# Altium schematic sheet stm32-motor-driver.SchDoc
size Letter
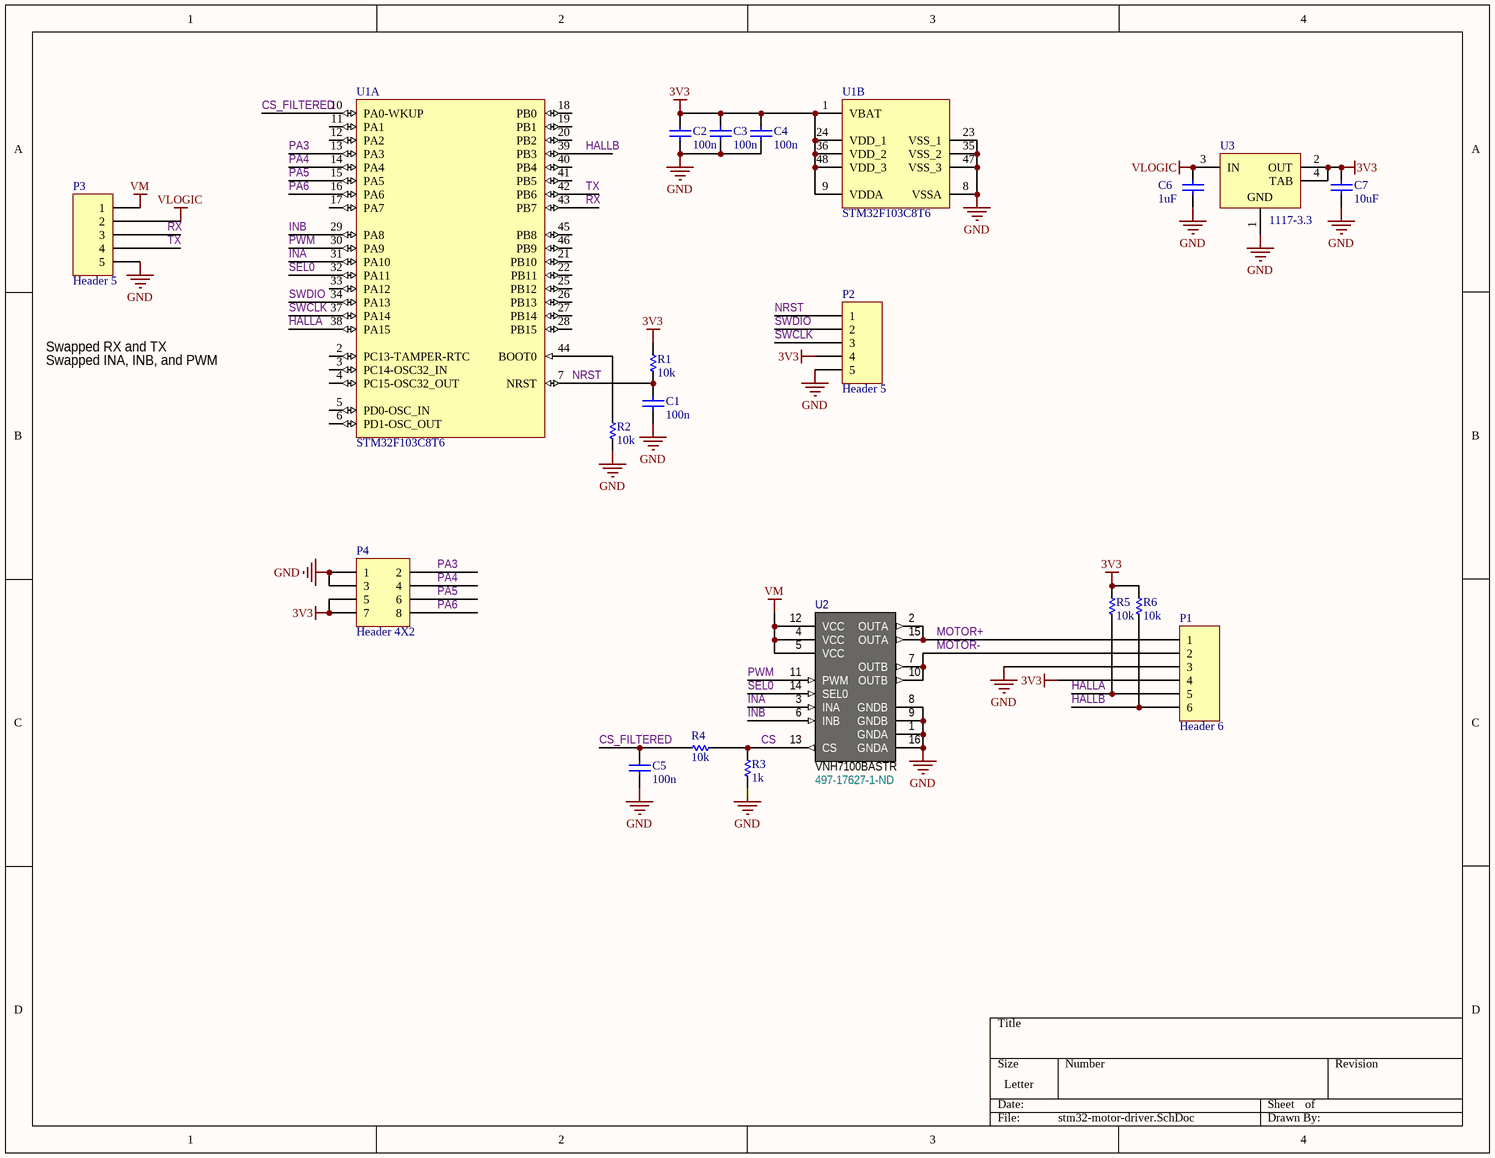
[diagram p0: stm32-motor-driver.SchDoc]

## Parts
C1  value 100n  [CAPC1608N]
C2  value 100n  [CAPC1608N]
C3  value 100n  [CAPC1608N]
C4  value 100n  [CAPC1608N]
C5  value 100n  [CAPC1608N]
C6  value 1uF  [CAPC1608N]
C7  value 10uF  [CAPC1608N]
P1  Header 6  [HDR1X6-PINS]
P2  Header 5  [HDR1X5]
P3  Header 5  [HDR1X5]
P4  Header 4X2  [HDR2X4]
R1  value 10k  [RESC1608N]
R2  value 10k  [RESC1608N]
R3  value 1k  [RESC1608N]
R4  value 10k  [RESC1608N]
R5  value 10k  [RESC1608N]
R6  value 10k  [RESC1608N]
U1  STM32F103C8T6  [STM-LQFP48_L]  (parts A,B of 2)
U2  VNH7100BASTR  Supplier Part Number 1: 497-17627-1-ND  [SOIC127P600-16N]
U3  1117-3.3  [DCY0004A_N]

## Nets
3V3: C2.2 C3.2 C4.2 C7.2 P1.4 P2.4 P4.5 P4.7 R1.2 R5.2 R6.2 U1.1(VBAT) U1.9(VDDA) U1.24(VDD_1) U1.36(VDD_2) U1.48(VDD_3) U3.2(OUT) U3.4(TAB)
GND: C1.1 C2.1 C3.1 C4.1 C5.1 C6.1 C7.1 P1.3 P2.5 P3.5 P4.1 P4.3 R2.1 R3.1 U1.8(VSSA) U1.23(VSS_1) U1.35(VSS_2) U1.47(VSS_3) U2.1(GNDA) U2.8(GNDB) U2.9(GNDB) U2.16(GNDA) U3.1(GND)
VLOGIC: C6.2 P3.2 U3.3(IN)
VM: P3.1 U2.4(VCC) U2.5(VCC) U2.12(VCC)
CS: R3.2 R4.1 U2.13(CS)
CS_FILTERED: C5.2 R4.2 U1.10(PA0-WKUP)
HALLA: P1.5 R5.1 U1.38(PA15)
HALLB: P1.6 R6.1 U1.39(PB3)
INA: U1.31(PA10) U2.3(INA)
INB: U1.29(PA8) U2.6(INB)
MOTOR+: P1.1 U2.2(OUTA) U2.15(OUTA)
MOTOR-: P1.2 U2.7(OUTB) U2.10(OUTB)
NRST: C1.2 P2.1 R1.1 U1.7(NRST)
PA3: P4.2 U1.13(PA3)
PA4: P4.4 U1.14(PA4)
PA5: P4.6 U1.15(PA5)
PA6: P4.8 U1.16(PA6)
PWM: U1.30(PA9) U2.11(PWM)
RX: P3.3 U1.43(PB7)
SEL0: U1.32(PA11) U2.14(SEL0)
SWCLK: P2.3 U1.37(PA14)
SWDIO: P2.2 U1.34(PA13)
TX: P3.4 U1.42(PB6)
NetR2_2: R2.2 U1.44(BOOT0)

Not connected (* = marked no-connect by the designer): U1 2(PC13-TAMPER-RTC) 3(PC14-OSC32_IN) 4(PC15-OSC32_OUT) 5(PD0-OSC_IN) 6(PD1-OSC_OUT) 11(PA1) 12(PA2) 17(PA7) 18(PB0) 19(PB1) 20(PB2) 21(PB10) 22(PB11) 25(PB12) 26(PB13) 27(PB14) 28(PB15) 33(PA12) 40(PB4) 41(PB5) 45(PB8) 46(PB9)

## Notes on the sheet
- Swapped RX and TX
- Swapped INA, INB, and PWM

## Library data of the parts
C1-C7 = Cap Chip: Capacitor; Tolerance: %; Manufacturer 1: *; Manufacturer 2: *; Manufacturer Part Number 1: *; Manufacturer Part Number 2: *; Supplier 1: *; Supplier 2: *; Supplier Part Number 1: *; Supplier Part Number 2: *
P1 = Header 6: Header, 6-Pin; LatestRevisionDate: 17-Jul-2002; LatestRevisionNote: Re-released for DXP Platform.; Publisher: Altium Limited
P2 P3 = Header 5: Header, 5-Pin; LatestRevisionDate: 17-Jul-2002; LatestRevisionNote: Re-released for DXP Platform.; Publisher: Altium Limited
P4 = Header 4X2: Header, 4-Pin, Dual row; LatestRevisionDate: 17-Jul-2002; LatestRevisionNote: Re-released for DXP Platform.; Publisher: Altium Limited
R1-R6 = Res Chip: Chip Resistor; Tolerance: %; Manufacturer 1: *; Manufacturer 2: *; Manufacturer Part Number 2: *; Manufacturer Part Number 1: *; Supplier Part Number 2: *; Supplier Part Number 1: *; Supplier 1: *; Supplier 2: *
U1 = CMP-0237-00215-3: ARM Cortex-M3 32-bit MCU, 64 KB Flash, 20 KB Internal RAM, 37 I/Os, 48-pin LQFP, -40 to 85 degC, Tray; Supply Voltage(Vcc) min (V): 2; Internal RAM Size (kB): 20; FLASH Size (Prog) (kB): 64; A/D Converter: 2x12-bit (10 Channel); I/Os (High Current): 37; Operating Frequency(F) (Processor speed) (MHz): 72; Core: ARM Cortex-M3; ComponentLink3Description: Package Specification; Mounting Technology: Surface Mount; PartNumber: STM32F103C8T6; PackageReference: LQFP48; Packing: Tray; ComponentLink3URL: http://www.st.com/st-web-ui/static/active/en/resource/technical/document/datasheet/DM00058181.pdf; DatasheetVersion: Rev. 16; ComponentLink1URL: http://www.st.com/web/en/home.html; PackageVersion: Rev. 6, 06/2013; ComponentLink2URL: http://www.st.com/st-web-ui/static/active/en/resource/technical/document/datasheet/CD00161566.pdf; ComponentLink1Description: Manufacturer URL; ComponentLink2Description: Datasheet; PackageDescription: 48-Pin Low Profile Quad Flat Package, 7 x 7 mm Body, 0.5 mm Pitch
U2 = VNH7100BASTR: SO 16 .15 TO JEDEC MS-012; Manufacturer: STMicroelectronics; Motor Type - AC, DC: Brushed DC; Function: Driver - Fully Integrated, Control and Power Stage; Output Configuration: Half Bridge (2); Interface: PWM; Current - Output: 15A; Voltage - Supply: 4 V ~ 28 V; Supplier 1: Digi-Key; Manufacturer Part Number: VNH7100BASTR; RoHS: RoHS Compliant; Category: Integrated Circuits (ICs); Stock 1: 100; Pricing 1: 1=3.2, 10=2.871, 100=2.352, 500=2.00218, 1000=1.68858 (USD); Packaging: Cut Tape (CT); Part Status: Active; Motor Type - Stepper: -; Technology: Power MOSFET; Step Resolution: -; Applications: Automotive; Voltage - Load: 4 V ~ 28 V; Operating Temperature: -40°C ~ 150°C (TJ); Mounting Type: Surface Mount; Package / Case: 16-SOIC (0.154", 3.90mm Width); Supplier Device Package: 16-SO; ComponentLink1URL: http://www.st.com/content/ccc/resource/technical/document/datasheet/group3/28/a2/d7/89/b7/da/4f/5c/DM00314832/files/DM00314832.pdf/jcr:content/translations/en.DM00314832.pdf; ComponentLink1Description: http://www.st.com/content/ccc/resource/technical/document/datasheet/group3/28/a2/d7/89/b7/da/4f/5c/DM00314832/files/DM00314832.pdf/jcr:content/translations/en.DM00314832.pdf
U3 = CMP-0062-01631-4: 800mA Low-Dropout Linear Regulator, 4-pin SOT-223, Pb-Free; PartNumber: LM1117IMP-3.3/NOPB; Manufacturer: Texas Instruments; PackageTopMarking: XYTT*N05B; PowerWise: N; High-Reliability: Y; CompType: LDO IC; Code_IPC: SOT223-4; PackageReference: DCY0004A; PinCount: 4; PackageDescription: Molded SOT-223, 6.50 x 3.56 x 1.6mm Body, 4 Lead, 2.3mm Pitch; RoHS: Y; ComponentLink1Description: Datasheet URL; Code_JEDEC: TO-261-AA; ComponentLink1URL: http://www.ti.com/general/docs/lit/getliterature.tsp?genericPartNumber=LM1117-N&fileType=pdf